# Altium project NoFollowBoard.PrjPcb
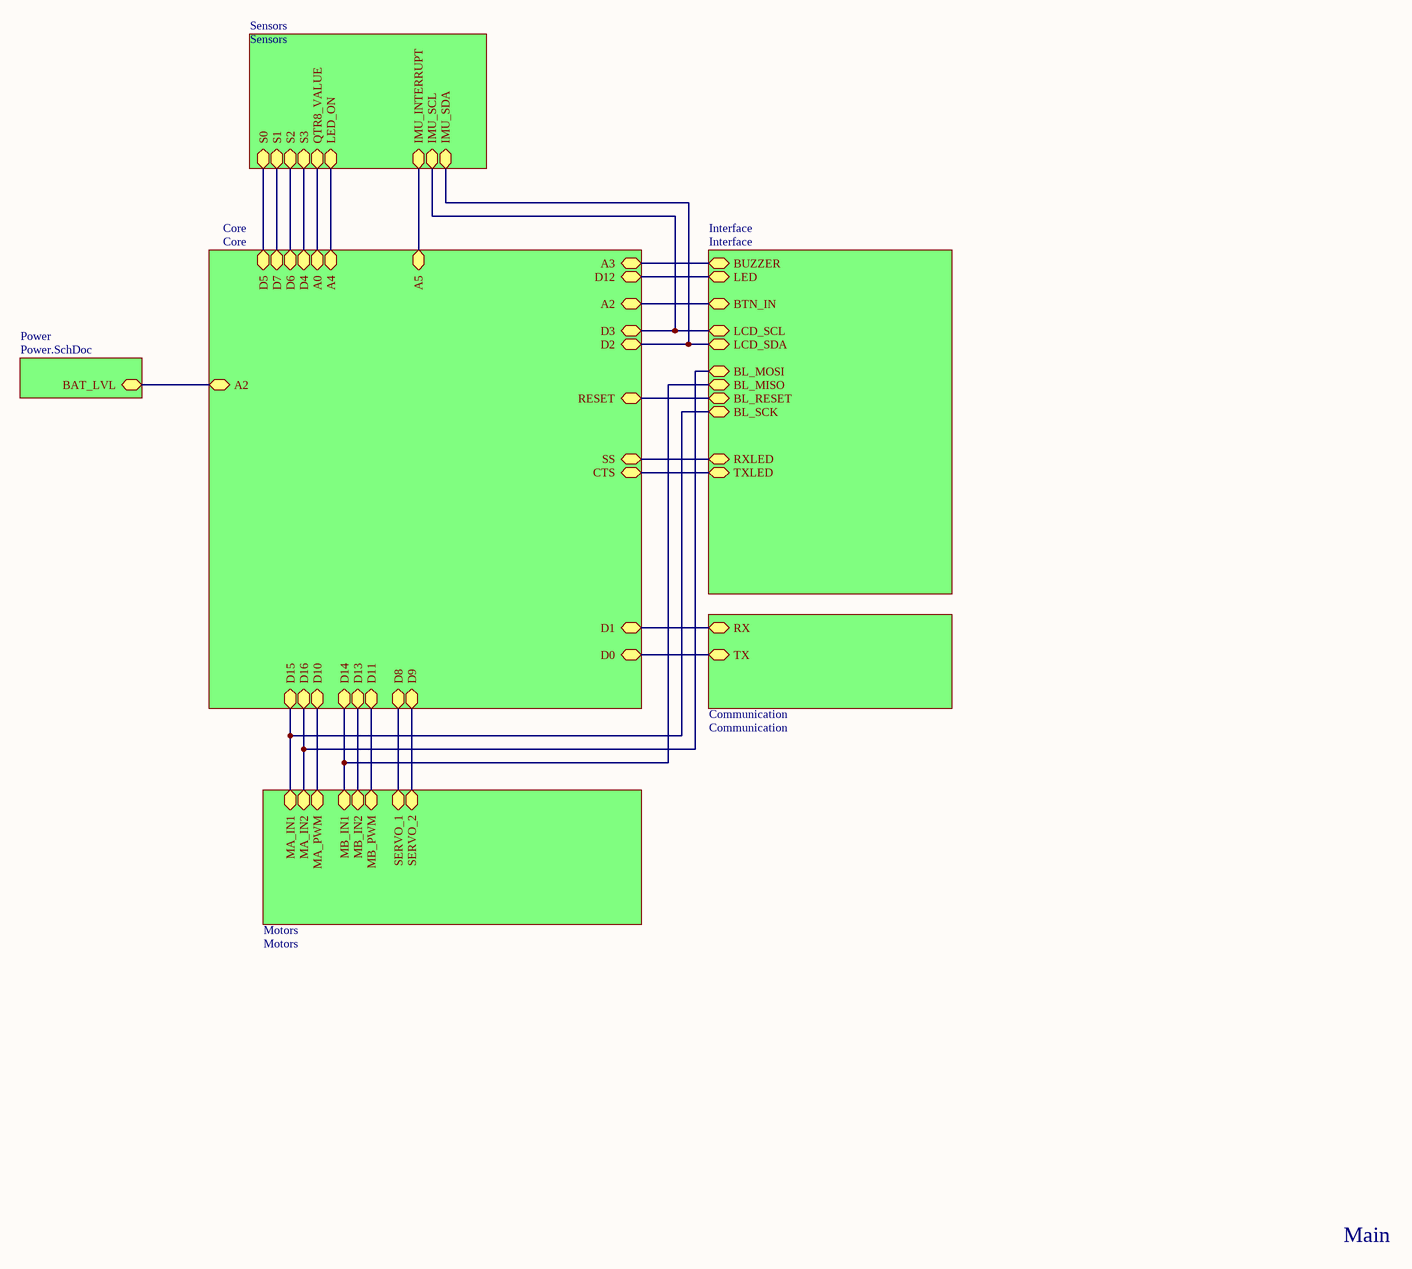
[diagram p0: Main.SchDoc]
6 sheets, 64 parts. Net scope: hierarchical (ports join the sheet entries above them; power ports are global).
Sheets:
  Main.SchDoc
    Core = Core.SchDoc
    Sensors = Sensors.SchDoc
    Interface = Interface.SchDoc
    Communication = Communication.SchDoc
    Motors = Motors.SchDoc

## Sheet Main.SchDoc
size A3

### Sub-sheets
Communication = Communication: RX (bidir), TX (bidir)
Core = Core: D5 (bidir), D7 (bidir), D6 (bidir), D4 (bidir), A0 (bidir), A3 (bidir), D12 (bidir), A2 (bidir), D1 (bidir), D0 (bidir), D13 (bidir), D14 (bidir), D10 (bidir), D16 (bidir), D15 (bidir), D11 (bidir), D8 (bidir), A4, A2, D9, RESET, SS (bidir), CTS (bidir), D3, D2, A5
Interface = Interface: BUZZER (bidir), LED (bidir), BTN_IN (bidir), LCD_SCL (bidir), LCD_SDA (bidir), BL_MOSI, BL_MISO, BL_RESET, BL_SCK, RXLED (bidir), TXLED (bidir)
Motors = Motors: MA_IN1 (bidir), MA_IN2 (bidir), MA_PWM (bidir), MB_IN1 (bidir), MB_IN2 (bidir), MB_PWM (bidir), SERVO_1 (bidir), SERVO_2
Power = Power.SchDoc (file not in this document): BAT_LVL
Sensors = Sensors: S0 (bidir), S1 (bidir), S2 (bidir), S3 (bidir), QTR8_VALUE (bidir), LED_ON, IMU_INTERRUPT (bidir), IMU_SCL (bidir), IMU_SDA (bidir)

### Nets
RESET: sheet Core/RESET, sheet Interface/BL_RESET
NetB1_B: sheet Core/A2, sheet Core/A2, sheet Interface/BTN_IN, sheet Power/BAT_LVL
NetGY1_3: sheet Core/D3, sheet Sensors/IMU_SCL, sheet Interface/LCD_SCL
NetGY1_4: sheet Core/D2, sheet Sensors/IMU_SDA, sheet Interface/LCD_SDA
NetGY1_8: sheet Core/A5, sheet Sensors/IMU_INTERRUPT
NetJ2_1: sheet Core/D14, sheet Interface/BL_MISO, sheet Motors/MB_IN1
NetJ2_3: sheet Core/D15, sheet Interface/BL_SCK, sheet Motors/MA_IN1
NetJ2_4: sheet Core/D16, sheet Interface/BL_MOSI, sheet Motors/MA_IN2
NetJ4_3: sheet Core/D8, sheet Motors/SERVO_1
NetJ5_3: sheet Core/D9, sheet Motors/SERVO_2
NetJ6_9: sheet Core/A4, sheet Sensors/LED_ON
NetLED_Rx_1: sheet Core/SS, sheet Interface/RXLED
NetLED_Tx_1: sheet Core/CTS, sheet Interface/TXLED
NetMUX1_1: sheet Core/A0, sheet Sensors/QTR8_VALUE
NetMUX1_10: sheet Core/D5, sheet Sensors/S0
NetMUX1_11: sheet Core/D7, sheet Sensors/S1
NetMUX1_13: sheet Core/D4, sheet Sensors/S3
NetMUX1_14: sheet Core/D6, sheet Sensors/S2
NetR1_2: sheet Core/D1, sheet Communication/RX
NetR7_2: sheet Core/D12, sheet Interface/LED
NetR8_2: sheet Core/A3, sheet Interface/BUZZER
NetR13_2: sheet Core/D13, sheet Motors/MB_IN2
NetU1_12: sheet Core/D11, sheet Motors/MB_PWM
NetU1_20: sheet Core/D0, sheet Communication/TX
NetU1_30: sheet Core/D10, sheet Motors/MA_PWM

### Notes on the sheet
- Main

## Sheet Core.SchDoc
size A
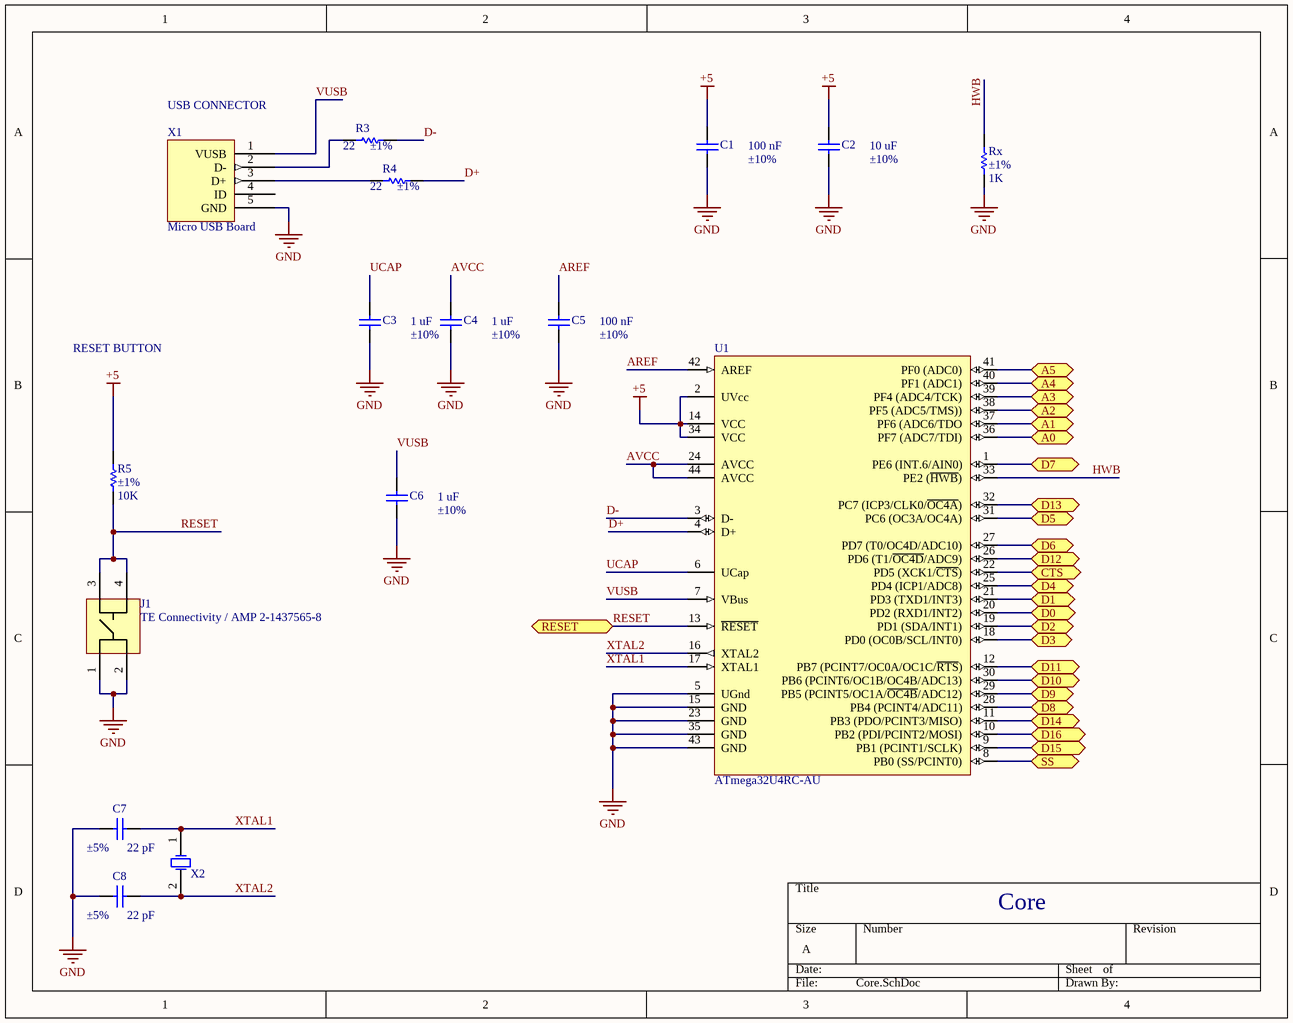
[diagram p1: Core.SchDoc]

### Parts
C1  Capacitance: 100 nF  Capacitance Tolerance: ±10%  [PCB-i747o4qnz4fc2aqkwc14-1]  (hidden comment: Taiyo Yuden LMK212BJ106KG-T)
C2  Capacitance: 10 uF  Capacitance Tolerance: ±10%  [PCB-i747o4qnz4fc2aqkwc14-1]  (hidden comment: Taiyo Yuden LMK212BJ106KG-T)
C3  Capacitance: 1 uF  Capacitance Tolerance: ±10%  [PCB-i747o4qnz4fc2aqkwc14-1]  (hidden comment: Taiyo Yuden LMK212BJ106KG-T)
C4  Capacitance: 1 uF  Capacitance Tolerance: ±10%  [PCB-i747o4qnz4fc2aqkwc14-1]  (hidden comment: Taiyo Yuden LMK212BJ106KG-T)
C5  Capacitance: 100 nF  Capacitance Tolerance: ±10%  [PCB-i747o4qnz4fc2aqkwc14-1]  (hidden comment: Taiyo Yuden LMK212BJ106KG-T)
C6  Capacitance: 1 uF  Capacitance Tolerance: ±10%  [PCB-i747o4qnz4fc2aqkwc14-1]  (hidden comment: Taiyo Yuden LMK212BJ106KG-T)
C7  Capacitance: 22 pF  Capacitance Tolerance: ±5%  [PCB-i747o4qnz4fc2aqkwc14-1]  (hidden comment: Taiyo Yuden LMK212BJ106KG-T)
C8  Capacitance: 22 pF  Capacitance Tolerance: ±5%  [PCB-i747o4qnz4fc2aqkwc14-1]  (hidden comment: Taiyo Yuden LMK212BJ106KG-T)
J1  TE Connectivity / AMP 2-1437565-8  [PCB-70k6oqbhuv68f7gyhifn-1]
R3  Resistance Tolerance: ±1%  Resistance: 22  [PCB-4097432-1]  (hidden comment: Bourns CR0805-FX-4701GLF)
R4  Resistance Tolerance: ±1%  Resistance: 22  [PCB-4097432-1]  (hidden comment: Bourns CR0805-FX-4701GLF)
R5  Resistance Tolerance: ±1%  Resistance: 10K  [PCB-4097432-1]  (hidden comment: Bourns CR0805-FX-4701GLF)
Rx  Resistance Tolerance: ±1%  Resistance: 1K  [PCB-4097432-1]  (hidden comment: Bourns CR0805-FX-4701GLF)
U1  ATmega32U4RC-AU  [44ML_L]
X1  Micro USB Board  [PCB-y0d6oczsv3eu57ue5a53-1]
X2  Fox Electronics FOXSDLF/160-20  [FOX-FOXSDLF-160-20]  (value not drawn)

### Ports
A0 (bidir), A1 (bidir), A2 (bidir), A3 (bidir), A4 (bidir), A5 (bidir), CTS (bidir), D0 (bidir), D1 (bidir), D2 (bidir), D3 (bidir), D4 (bidir), D5 (bidir), D6 (bidir), D7 (bidir), D8 (bidir), D9 (bidir), D10 (bidir), D11 (bidir), D12 (bidir), D13 (bidir), D14 (bidir), D15 (bidir), D16 (bidir), RESET, SS (bidir)

### Nets
+5: C1.2 C2.2 R5.2 U1.2(UVcc) U1.14(VCC) U1.34(VCC)
GND: C1.1 C2.1 C3.1 C4.1 C5.1 C6.1 C7.1 C8.1 J1.1 J1.2 Rx.1 U1.5(UGnd) U1.15(GND) U1.23(GND) U1.35(GND) U1.43(GND) X1.5(GND)
AREF: C5.2 U1.42(AREF)
AVCC: C4.2 U1.24(AVCC) U1.44(AVCC)
D+: R4.2 U1.4(D+)
D-: R3.2 U1.3(D-)
HWB: Rx.2 U1.33(PE2_(~{HWB}))
RESET: J1.3 J1.4 R5.1 U1.13(~{RESET}) ; port RESET
UCAP: C3.2 U1.6(UCap)
VUSB: C6.2 U1.7(VBus) X1.1(VUSB)
XTAL1: C7.2 U1.17(XTAL1) X2.1(OSC1)
XTAL2: C8.2 U1.16(XTAL2) X2.2(OSC2)
NetB1_B: U1.38(PF5_(ADC5/TMS))) ; port A2
NetGY1_3: U1.18(PD0_(OC0B/SCL/INT0)) ; port D3
NetGY1_4: U1.19(PD1_(SDA/INT1)) ; port D2
NetGY1_8: U1.41(PF0_(ADC0)) ; port A5
NetJ2_1: U1.11(PB3_(PDO/PCINT3/MISO)) ; port D14
NetJ2_3: U1.9(PB1_(PCINT1/SCLK)) ; port D15
NetJ2_4: U1.10(PB2_(PDI/PCINT2/MOSI)) ; port D16
NetJ4_3: U1.28(PB4_(PCINT4/ADC11)) ; port D8
NetJ5_3: U1.29(PB5_(PCINT5/OC1A/~{OC4B}/ADC12)) ; port D9
NetJ6_9: U1.40(PF1_(ADC1)) ; port A4
NetLED_Rx_1: U1.8(PB0_(SS/PCINT0)) ; port SS
NetLED_Tx_1: U1.22(PD5_(XCK1/~{CTS})) ; port CTS
NetMUX1_1: U1.36(PF7_(ADC7/TDI)) ; port A0
NetMUX1_10: U1.31(PC6_(OC3A/OC4A)) ; port D5
NetMUX1_11: U1.1(PE6_(INT.6/AIN0)) ; port D7
NetMUX1_13: U1.25(PD4_(ICP1/ADC8)) ; port D4
NetMUX1_14: U1.27(PD7_(T0/OC4D/ADC10)) ; port D6
NetR1_2: U1.21(PD3_(TXD1/INT3)) ; port D1
NetR3_1: R3.1 X1.2(D-)
NetR4_1: R4.1 X1.3(D+)
NetR7_2: U1.26(PD6_(T1/~{OC4D}/ADC9)) ; port D12
NetR8_2: U1.39(PF4_(ADC4/TCK)) ; port A3
NetR13_2: U1.32(PC7_(ICP3/CLK0/~{OC4A})) ; port D13
NetU1_12: U1.12(PB7_(PCINT7/OC0A/OC1C/~{RTS})) ; port D11
NetU1_20: U1.20(PD2_(RXD1/INT2)) ; port D0
NetU1_30: U1.30(PB6_(PCINT6/OC1B/OC4B/ADC13)) ; port D10
NetU1_37: U1.37(PF6_(ADC6/TDO) ; port A1

Not connected (* = marked no-connect by the designer): X1 4(ID)

### Notes on the sheet
- (near X1) USB CONNECTOR
- RESET BUTTON
- Core

### Library data of the parts
C1-C8 = CMP-6ecba7c24c09b10c-2: Cap Ceramic 10uF 10V X5R 10% SMD 0805 85?C T/R; Lead-Free Status: Lead Free; Voltage Rating (DC): 10.0 V; Case/Package (SI): 2012; Mounting Style: Surface Mount; Manufacturer Part Number: LMK212BJ106KG-T; Packaging: Cut Tape (CT); RoHS: Compliant; Number of Pins: 2; Lifecycle Status: Not Listed by Manufacturer; OctopartID: 6ecba7c24c09b10c; Size-Length: 0.002 m; Size-Height: 0.00125 m; Dielectric Characteristic: X5R; Octopart URL: http://octopart.com/lmk212bj106kg-t-taiyo+yuden-198564; Size-Width: 0.00125 m; Case/Package: 0805
J1 = 2-1437565-8: Switch Tactile OFF (ON) SPST Round Button Gull Wing 0.05A 12VDC 2.55N SMD Loose Piece; ELV Compliant: Compliant; Lead-Free Status: Lead Free; Contact Material: Copper Alloy; Contacts Type: SPST; Mounting Style: Surface Mount; OctopartID: fb7e300dae6a24b9; Lifecycle Status: Active; Manufacturer Part Number: 2-1437565-8; Contact Plating: Silver; RoHS: Compliant; Octopart URL: http://octopart.com/2-1437565-8-te+connectivity+%2F+amp-41513074
R3-R5 Rx = CMP-97505e06006c4897-1: Res Thick Film 0805 4.7K Ohm 1% 1/8W ±100ppm/°C Molded SMD SMD Paper Tape on Plastic Reel; Voltage Rating (DC): 150 V; Power Rating: 125 mW; Manufacturer Part Number: CR0805-FX-4701GLF; REACH SVHC Compliance: No SVHC; OctopartID: 97505e06006c4897; Packaging: Tape & Reel (TR), Cut Tape (CT); Octopart URL: http://octopart.com/cr0805-fx-4701glf-bourns-6074970; Number of Pins: 2; Mounting Style: Surface Mount; RoHS: Compliant; Size-Thickness: 508 µm; Size-Length: 2.01 mm; Case/Package: 0805; Size-Width: 1.24 mm
U1 = ATMEGA32U4RC-AU: 8-bit AVR Microcontroller, 2.7-5.5V, 16MHz, 32KB Flash, 1KB EEPROM, 2.5KB SRAM, USB Controller, 44-pin TQFP, Industrial Grade (-40°C to 85°C), Int RC; Manufacturer: Atmel; Processor Series: ATMEGA32x; CiivaID: 973239; On-Chip ADC: Yes; Data Bus Width: 8 bit; Operating Supply Voltage: 2.7 V to 5.5 V; Core: AVR; Data RAM Size: 2.5 KB; Mounting Style: SMD/SMT; Maximum Clock Frequency: 16 MHz; Operating Temperature Range: - 40 C to + 85 C; Program Memory Size: 32 KB; RoHS: Details; Package / Case: QFP-44; Factory Pack Quantity: 800; Ciiva URL: https://ciiva.com/part/atmega32u4rc-au-973239
X1 = CMP-dryhiu0utvtqwfw1f267-2: CustomComponentID: dryhiu0utvtqwfw1f267
X2 = CMP-779572-4: CRYSTAL 16.0MHZ 20PF SMD; Frequency: 16000000.0 Hz; Lead-Free Status: Lead Free; Load Capacitance: 2e-11 F; Size-Height: 0.0045 m; REACH SVHC Compliance: No SVHC; Size-Length: 0.0129 m; RoHS: Compliant; Mounting Style: Surface Mount; Case/Package: HC-49; Packaging: Cut Tape (CT); Octopart Url: https://octopart.com/foxsdlf%2F160-20-fox+electronics-126664; OctopartID: 4a7c837781d295bb; Number of Pins: 2; Size-Width: 0.005 m

## Sheet Sensors.SchDoc
size A3; PageSetup: Record=PageOptions|CenterHorizontal=True|CenterVertical=True|PrintScale=1.00|XCorrection=1.00|YCorrection=1.00|PrintKind=1|BorderSize=5000000|LeftOffset=0|BottomOffset=0|Orientation=2|PaperLength=1000|PaperWidth=1000|Scale=100|PaperSource=7|PrintQuality=-3|MediaType=1|DitherType=10|PrintScaleMode=1|PaperKind=A2|PaperIndex=66
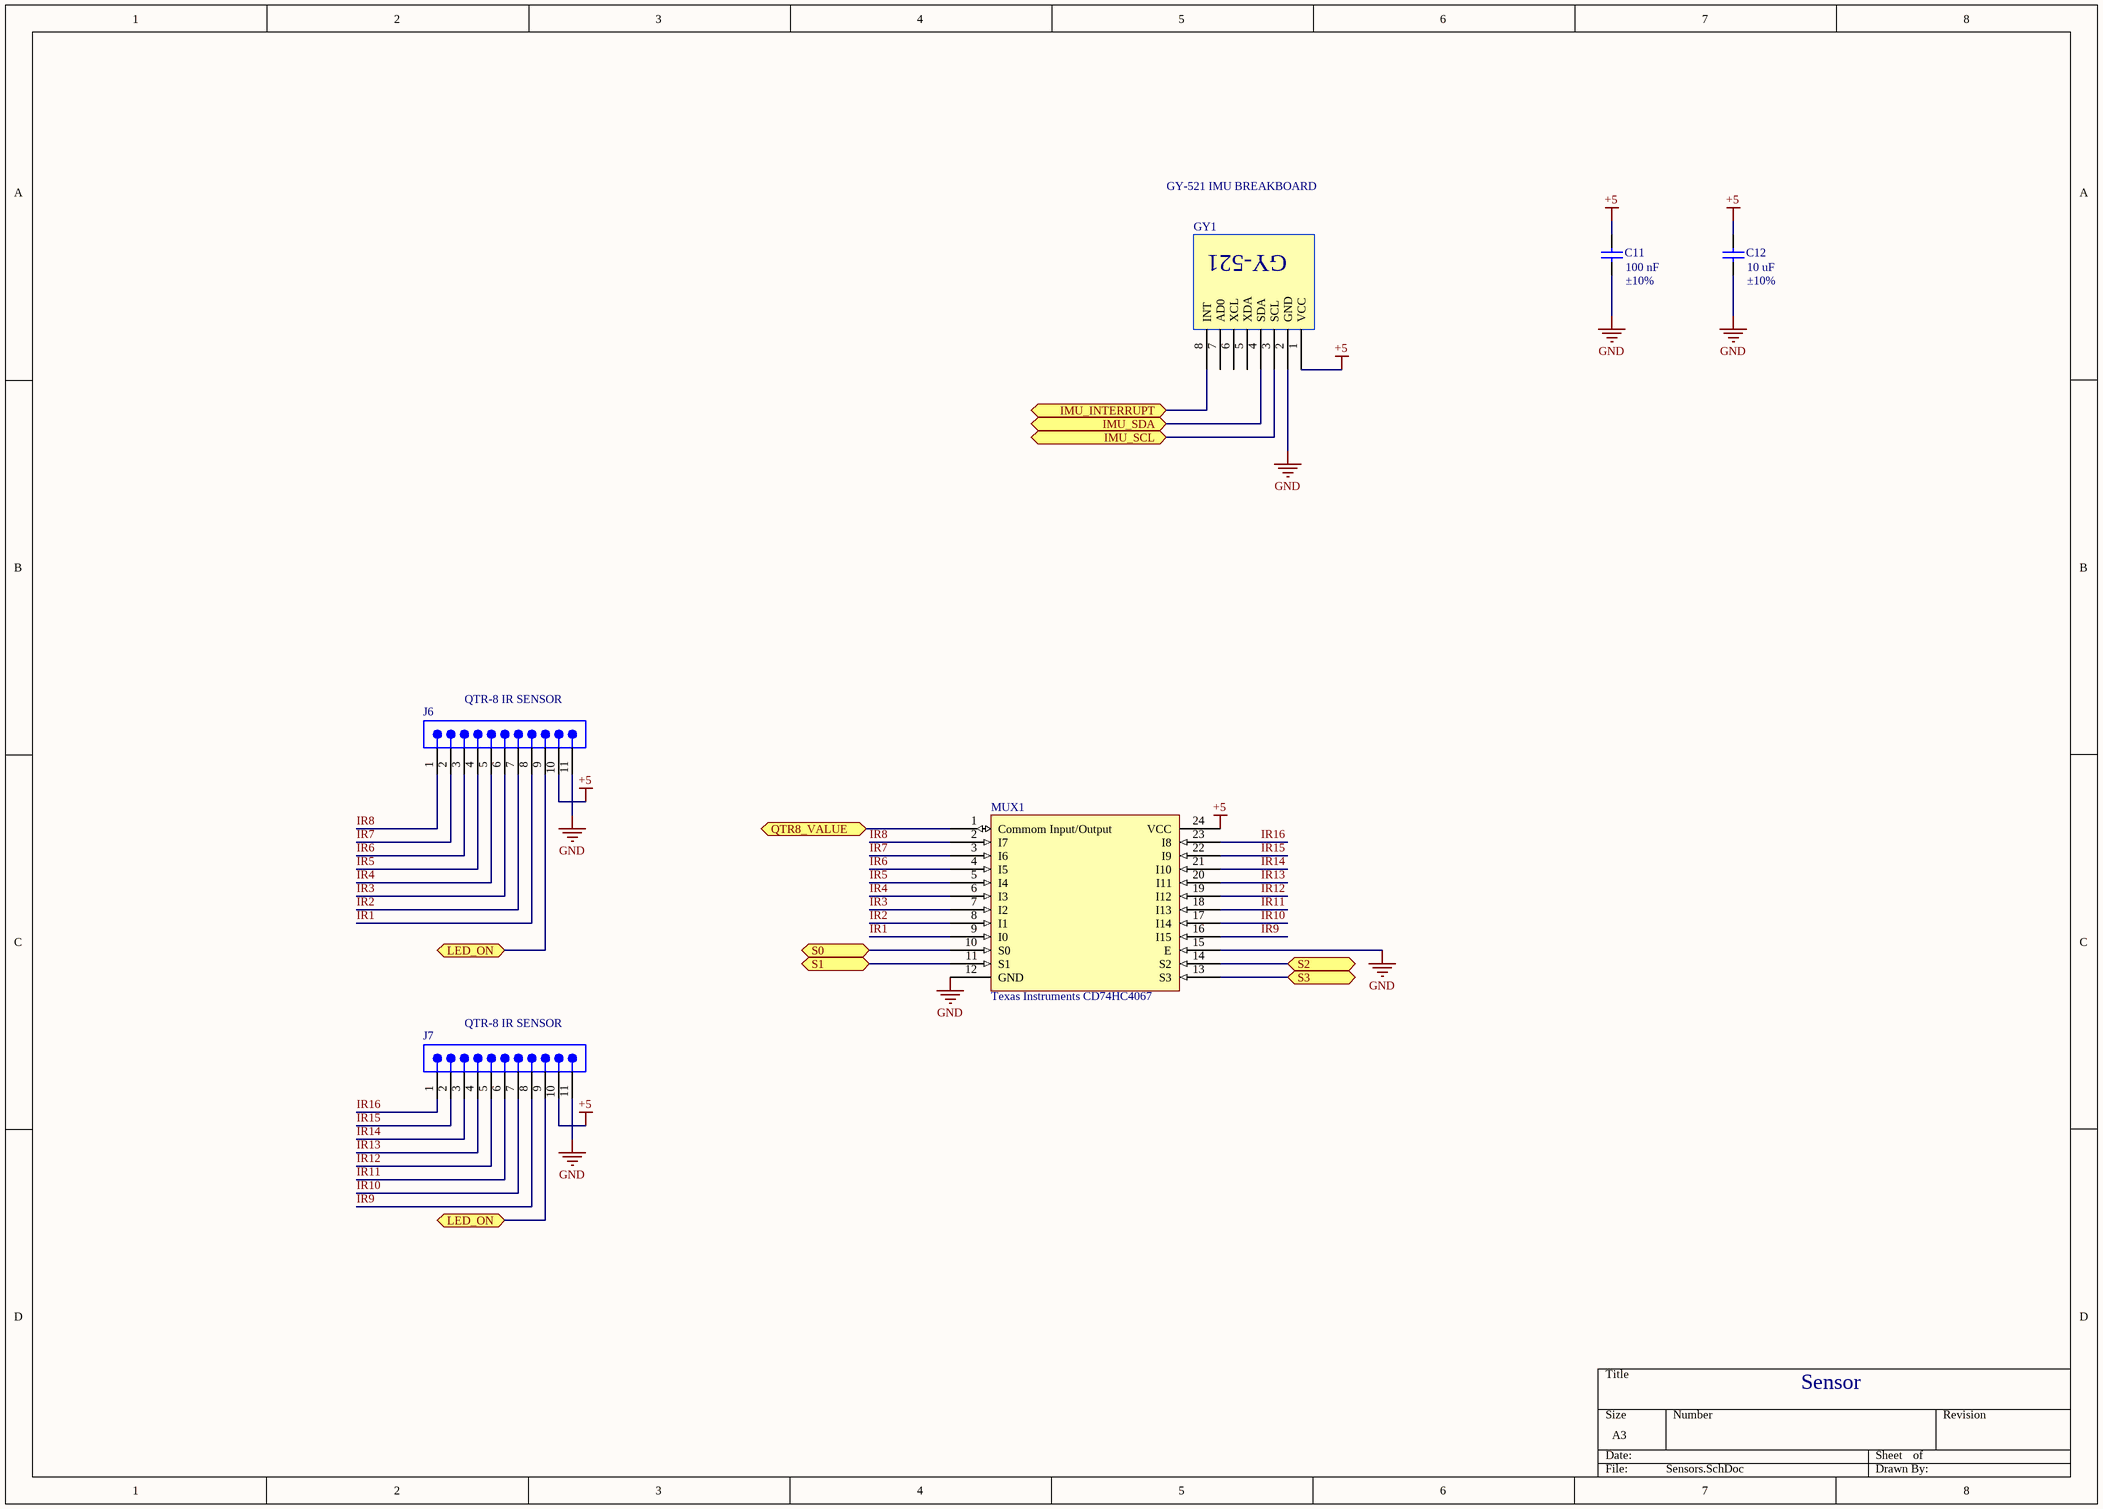
[diagram p2: Sensors.SchDoc]

### Parts
C11  Capacitance: 100 nF  Capacitance Tolerance: ±10%  [PCB-i747o4qnz4fc2aqkwc14-1]  (hidden comment: Taiyo Yuden LMK212BJ106KG-T)
C12  Capacitance: 10 uF  Capacitance Tolerance: ±10%  [PCB-i747o4qnz4fc2aqkwc14-1]  (hidden comment: Taiyo Yuden LMK212BJ106KG-T)
GY1  GY-521 MPU-6050 IMU  [PCBComponent_1]  (value not drawn)
J6  Samtec TSW-111-05-G-S  [1X11]  (value not drawn)
J7  Samtec TSW-111-05-G-S  [1X11]  (value not drawn)
MUX1  Texas Instruments CD74HC4067  [PCBComponent_1 - duplicate]

### Ports
IMU_INTERRUPT (bidir), IMU_SCL (bidir), IMU_SDA (bidir), LED_ON (bidir), QTR8_VALUE (bidir), S0 (bidir), S1 (bidir), S2 (bidir), S3 (bidir)

### Nets
+5: C11.2 C12.2 GY1.1(VCC) J6.10 J7.10 MUX1.24(VCC)
GND: C11.1 C12.1 GY1.2(GND) J6.11 J7.11 MUX1.12(GND) MUX1.15(E)
IR1: J6.8 MUX1.9(I0)
IR2: J6.7 MUX1.8(I1)
IR3: J6.6 MUX1.7(I2)
IR4: J6.5 MUX1.6(I3)
IR5: J6.4 MUX1.5(I4)
IR6: J6.3 MUX1.4(I5)
IR7: J6.2 MUX1.3(I6)
IR8: J6.1 MUX1.2(I7)
IR9: J7.8 MUX1.16(I15)
IR10: J7.7 MUX1.17(I14)
IR11: J7.6 MUX1.18(I13)
IR12: J7.5 MUX1.19(I12)
IR13: J7.4 MUX1.20(I11)
IR14: J7.3 MUX1.21(I10)
IR15: J7.2 MUX1.22(I9)
IR16: J7.1 MUX1.23(I8)
NetGY1_3: GY1.3(SCL) ; port IMU_SCL
NetGY1_4: GY1.4(SDA) ; port IMU_SDA
NetGY1_8: GY1.8(INT) ; port IMU_INTERRUPT
NetJ6_9: J6.9 J7.9 ; port LED_ON
NetMUX1_1: MUX1.1(Commom_Input/Output) ; port QTR8_VALUE
NetMUX1_10: MUX1.10(S0) ; port S0
NetMUX1_11: MUX1.11(S1) ; port S1
NetMUX1_13: MUX1.13(S3) ; port S3
NetMUX1_14: MUX1.14(S2) ; port S2

Not connected (* = marked no-connect by the designer): GY1 5(XDA) 6(XCL) 7(AD0)

### Notes on the sheet
- GY-521 IMU BREAKBOARD
- (near J6) QTR-8 IR SENSOR
- (near J7) QTR-8 IR SENSOR
- Sensor
- (in symbol CMP-1172158-5) GY-521

### Library data of the parts
C11 C12 = CMP-6ecba7c24c09b10c-2: as C1 on sheet Core; Mounting Style: Surface Mount; Manufacturer Part Number: LMK212BJ106KG-T; Packaging: Cut Tape (CT); RoHS: Compliant; Number of Pins: 2; Lifecycle Status: Not Listed by Manufacturer; OctopartID: 6ecba7c24c09b10c; Size-Length: 0.002 m; Size-Height: 0.00125 m; Dielectric Characteristic: X5R; Octopart URL: http://octopart.com/lmk212bj106kg-t-taiyo+yuden-198564; Size-Width: 0.00125 m; Case/Package: 0805
GY1 = CMP-1172158-5: 3-axis gyroscope, 3-axis accelerometer breakout board; Supply Voltage (DC): 5v; Packaging: Cut Tape (CT); REACH SVHC Compliance: No SVHC; Number of Pins: 8; Octopart URL: http://octopart.com/mpu-6050-invensense-19505926; OctopartID: 29a8e18bafc8f66f; RoHS: Compliant; Manufacturer Part Number: MPU-6050
J6 J7 = CMP-3970764-2: CONN HEADER 11POS .100" SGL GOLD; Gender: Male; Lead-Free Status: Lead Free; Number of Contacts: 11; Pin Pitch: 0.00254 m; Contact Material: Phosphor Bronze; Contact Plating: Gold; Housing Color: Black; Housing Material: Plastic; Mounting Style: Through Hole; Number of Positions: 11; Number of Rows: 1; Octopart Url: https://octopart.com/tsw-111-05-g-s-samtec-271406; OctopartID: 84944d9a85dc5b53; REACH SVHC Compliance: No SVHC; RoHS: Compliant; Size-Height: 0.00254 m; Size-Length: 0.02794 m; Size-Width: 0.00254 m
MUX1 = CMP-106ed96303d9cfa9-6: High Speed CMOS 16-Channel Analog Multiplexer/Demultiplexer 24-SSOP -55 to 125; Manufacturer Part Number: CD74HC4067SM96; Supply Voltage (DC): 2.00 V (min); Number of Bits: 16; Lead-Free Status: Lead Free; Number of Circuits: 1; Polarity: Non-Inverting; Mounting Style: Surface Mount; OctopartID: 106ed96303d9cfa9; Case/Package: SSOP; Number of Outputs: 16; Number of Channels: 16; RoHS: Compliant; Number of Pins: 24; Lifecycle Status: Active; REACH SVHC Compliance: No SVHC; Packaging: Tape & Reel (TR), Cut Tape (CT); Octopart URL: http://octopart.com/cd74hc4067sm96-texas+instruments-472785

## Sheet Interface.SchDoc
size A
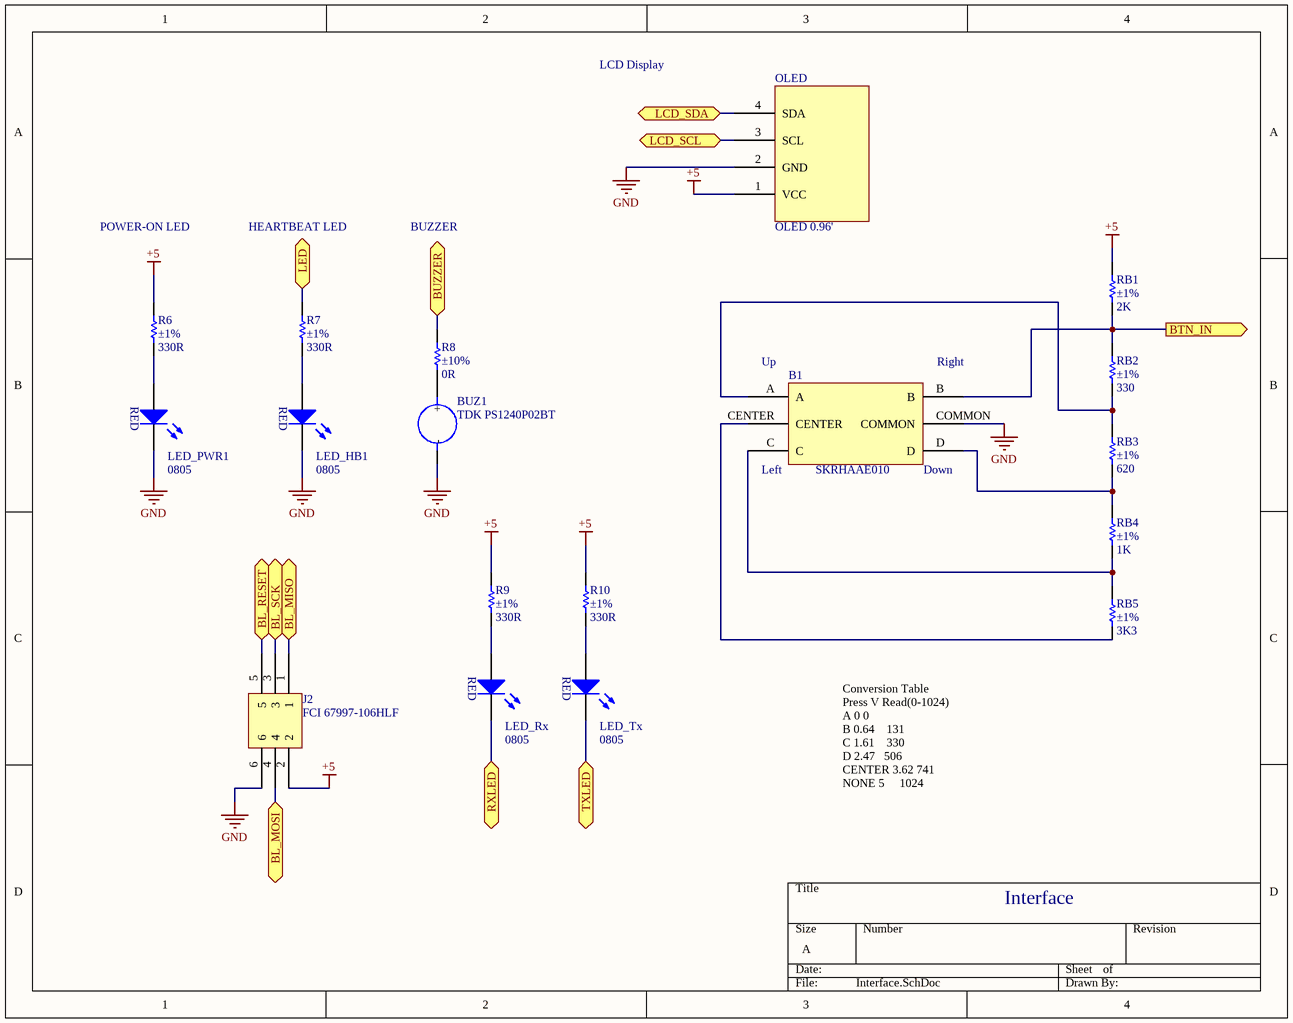
[diagram p3: Interface.SchDoc]

### Parts
B1  SKRHAAE010  [PCB-uddfpa39w3pawwu0f32n-1]
BUZ1  TDK PS1240P02BT  [2P-7.6-D12X6.5H]
J2  FCI 67997-106HLF  [PCB-94q9r8plw7fzhg0k9c12-1]
LED_HB1  Case/Package: 0805  [LED0805]  (hidden comment: CMP-7f15b6173d91a0d2-5)
LED_PWR1  Case/Package: 0805  [LED0805]  (hidden comment: CMP-7f15b6173d91a0d2-5)
LED_Rx  Case/Package: 0805  [LED0805]  (hidden comment: CMP-7f15b6173d91a0d2-5)
LED_Tx  Case/Package: 0805  [LED0805]  (hidden comment: CMP-7f15b6173d91a0d2-5)
OLED  OLED 0.96'  [PCBComponent_1 - duplicate]
R6  Resistance Tolerance: ±1%  Resistance: 330R  [PCB-4097432-1]  (hidden comment: Bourns CR0805-FX-4701GLF)
R7  Resistance Tolerance: ±1%  Resistance: 330R  [PCB-4097432-1]  (hidden comment: Bourns CR0805-FX-4701GLF)
R8  Resistance Tolerance: ±10%  Resistance: 0R  [PCB-4097432-1]  (hidden comment: Bourns CR0805-FX-4701GLF)
R9  Resistance Tolerance: ±1%  Resistance: 330R  [PCB-4097432-1]  (hidden comment: Bourns CR0805-FX-4701GLF)
R10  Resistance Tolerance: ±1%  Resistance: 330R  [PCB-4097432-1]  (hidden comment: Bourns CR0805-FX-4701GLF)
RB1  Resistance Tolerance: ±1%  Resistance: 2K  [PCB-4097432-1]  (hidden comment: Bourns CR0805-FX-4701GLF)
RB2  Resistance Tolerance: ±1%  Resistance: 330  [PCB-4097432-1]  (hidden comment: Bourns CR0805-FX-4701GLF)
RB3  Resistance Tolerance: ±1%  Resistance: 620  [PCB-4097432-1]  (hidden comment: Bourns CR0805-FX-4701GLF)
RB4  Resistance Tolerance: ±1%  Resistance: 1K  [PCB-4097432-1]  (hidden comment: Bourns CR0805-FX-4701GLF)
RB5  Resistance Tolerance: ±1%  Resistance: 3K3  [PCB-4097432-1]  (hidden comment: Bourns CR0805-FX-4701GLF)

### Ports
BL_MISO, BL_MOSI, BL_RESET, BL_SCK, BTN_IN (out), BUZZER (bidir), LCD_SCL (bidir), LCD_SDA (bidir), LED (bidir), RXLED (bidir), TXLED (bidir)

### Nets
+5: J2.2 OLED.1(VCC) R6.2 R9.2 R10.2 RB1.2
GND: B1.COMMON BUZ1.- J2.6 LED_HB1.1(K) LED_PWR1.1(K) OLED.2(GND)
RESET: J2.5 ; port BL_RESET
NetB1_A: B1.A RB2.1 RB3.2
NetB1_B: B1.B RB1.1 RB2.2 ; port BTN_IN
NetB1_C: B1.C RB4.1 RB5.2
NetB1_CENTER: B1.CENTER RB5.1
NetB1_D: B1.D RB3.1 RB4.2
NetBUZ1_+: BUZ1.+ R8.1
NetGY1_3: OLED.3(SCL) ; port LCD_SCL
NetGY1_4: OLED.4(SDA) ; port LCD_SDA
NetJ2_1: J2.1 ; port BL_MISO
NetJ2_3: J2.3 ; port BL_SCK
NetJ2_4: J2.4 ; port BL_MOSI
NetLED_HB1_2: LED_HB1.2(A) R7.1
NetLED_PWR1_2: LED_PWR1.2(A) R6.1
NetLED_Rx_1: LED_Rx.1(K) ; port RXLED
NetLED_Rx_2: LED_Rx.2(A) R9.1
NetLED_Tx_1: LED_Tx.1(K) ; port TXLED
NetLED_Tx_2: LED_Tx.2(A) R10.1
NetR7_2: R7.2 ; port LED
NetR8_2: R8.2 ; port BUZZER

### Notes on the sheet
- LCD Display
- POWER-ON LED
- HEARTBEAT LED
- BUZZER
- (near B1) Up
- (near B1) Right
- (near B1) Left
- (near B1) Down
- Conversion Table
  Press	V	Read(0-1024)
  A	0	0
  B	0.64   	131
  C	1.61   	330
  D	2.47  	506
  CENTER	3.62	741
  NONE	5    	1024
- Interface
- (in symbol CMP-7f15b6173d91a0d2-5) RED

### Library data of the parts
B1 = CMP-0t5k0v9upau5edea4oo5-8: TACT switch 4-direction with Center-Push Function (Surface Mount); CustomComponentID: 0t5k0v9upau5edea4oo5
BUZ1 = PS1240P02BT: Audio Indicator Buzzer Piezo 3Vo-p Pin Through Hole; Lead-Free Status: Lead Free; RoHS: Compliant; Octopart Url: http://octopart.com/ps1240p02bt-tdk-8602108; Seller Landing  Url: https://octopart-clicks.com/click/track?country=US&ak=8157f166&sig=0ee4d25&sid=5489&ppid=8602108&vpid=52084698&ct=offers; Manufacturer Part Number: PS1240P02BT; OctopartID: 93c85a41f7524c0f
J2 = CMP-c8f30399bb8b1734-1: Conn; Rect; Header; Unshrouded; 6 Pos; 2.54mm Pitch; 2-Row; Thru-Hole; BergStik; Number of Positions: 6; Gender: Male; Lead-Free Status: Lead Free; Contact Plating: Gold; RoHS: Compliant; Contact Material: Phosphor Bronze; Mounting Style: Through Hole; Pin Pitch: 2.54 mm; Number of Rows: 2; Number of Contacts: 6; Octopart URL: http://octopart.com/67997-106hlf-fci-39867934; OctopartID: c8f30399bb8b1734; Manufacturer Part Number: 67997-106HLF
LED_HB1 LED_PWR1 LED_Rx LED_Tx = CMP-7f15b6173d91a0d2-5: LED; SMD; 0805; red; 7.2-17mcd; 2x1.25mm; 170°; 1.8÷2.6V; 20mA; Manufacturer Part Number: HSMH-C170; Lead-Free Status: Lead Free; Lens Type: Diffused; Power Dissipation: 0.065 W; Voltage Rating (DC): 1.8 V; Luminous Intensity: 0.017 cd; Lens Color: Clear; Peak Wavelength: 6.6e-07 m; Wavelength: 6.39e-07 m; Case/Package (SI): 2012; RoHS: Compliant; Number of Pins: 2; Forward Voltage: 1.8 V; Packaging: Cut Tape (CT); Viewing Angle: 170 °; Octopart URL: http://octopart.com/hsmh-c170-avago-550882; REACH SVHC Compliance: No SVHC; Order Code (RS Components): 486-0468; Color: Red; OctopartID: 7f15b6173d91a0d2; Lifecycle Status: Active; Mounting Style: Surface Mount, Vertical; Part Description: *
OLED = CMP-am4xhbx8j6fw9q56sa5u-8: 0.96' oled i2c screen; CustomComponentID: am4xhbx8j6fw9q56sa5u
R6-R10 RB1-RB5 = CMP-97505e06006c4897-1: as R3 on sheet Core; Manufacturer Part Number: CR0805-FX-4701GLF; REACH SVHC Compliance: No SVHC; OctopartID: 97505e06006c4897; Packaging: Tape & Reel (TR), Cut Tape (CT); Octopart URL: http://octopart.com/cr0805-fx-4701glf-bourns-6074970; Number of Pins: 2; Mounting Style: Surface Mount; RoHS: Compliant; Size-Thickness: 508 µm; Size-Length: 2.01 mm; Case/Package: 0805; Size-Width: 1.24 mm

## Sheet Communication.SchDoc
size A
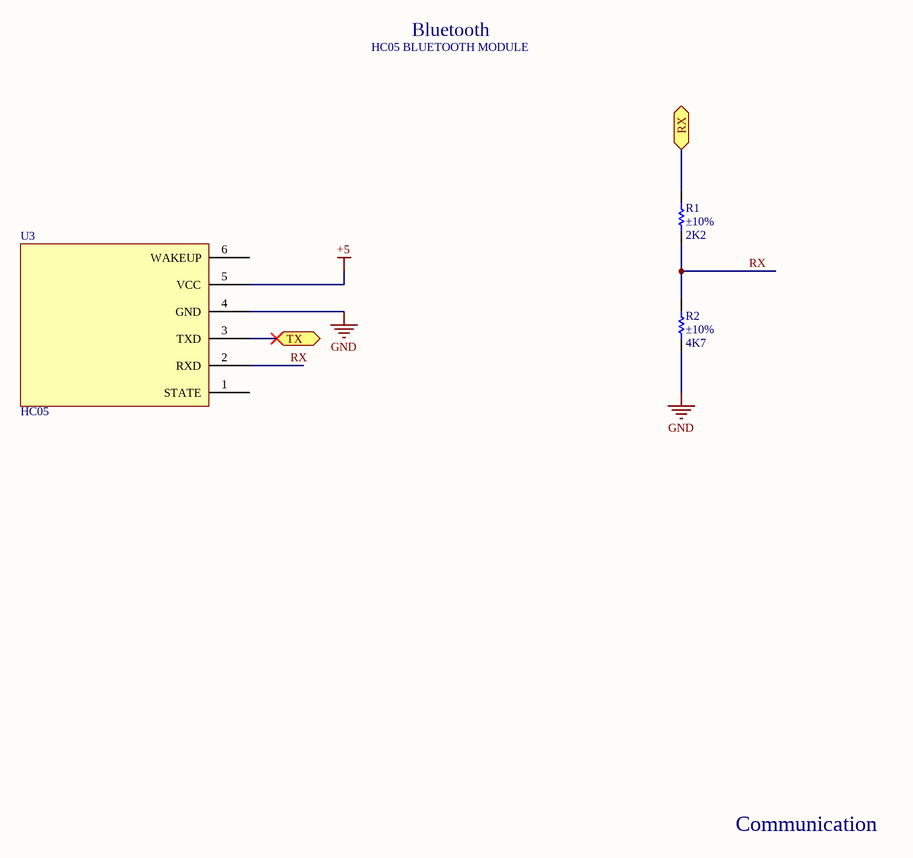
[diagram p4: Communication.SchDoc]

### Parts
R1  Resistance Tolerance: ±10%  Resistance: 2K2  [PCB-4097432-1]  (hidden comment: Bourns CR0805-FX-4701GLF)
R2  Resistance Tolerance: ±10%  Resistance: 4K7  [PCB-4097432-1]  (hidden comment: Bourns CR0805-FX-4701GLF)
U3  HC05  [PCB-y69srl1b5ua4hsssdbd0-1]

### Ports
RX (bidir), TX (bidir)

### Nets
+5: U3.5(VCC)
GND: R2.1 U3.4(GND)
RX: R1.1 R2.2 U3.2(RXD)
NetR1_2: R1.2 ; port RX
NetU1_20: U3.3(TXD) ; port TX

Not connected (* = marked no-connect by the designer): U3 1(STATE) 6(WAKEUP)

### Notes on the sheet
- HC05 BLUETOOTH MODULE
- Bluetooth
- Communication

### Library data of the parts
R1 R2 = CMP-97505e06006c4897-1: as R3 on sheet Core; Manufacturer Part Number: CR0805-FX-4701GLF; REACH SVHC Compliance: No SVHC; OctopartID: 97505e06006c4897; Packaging: Tape & Reel (TR), Cut Tape (CT); Octopart URL: http://octopart.com/cr0805-fx-4701glf-bourns-6074970; Number of Pins: 2; Mounting Style: Surface Mount; RoHS: Compliant; Size-Thickness: 508 µm; Size-Length: 2.01 mm; Case/Package: 0805; Size-Width: 1.24 mm
U3 = CMP-32y43k4doi7edrbsy63c-2: hc05 BT module; CustomComponentID: 32y43k4doi7edrbsy63c

## Sheet Motors.SchDoc
size A
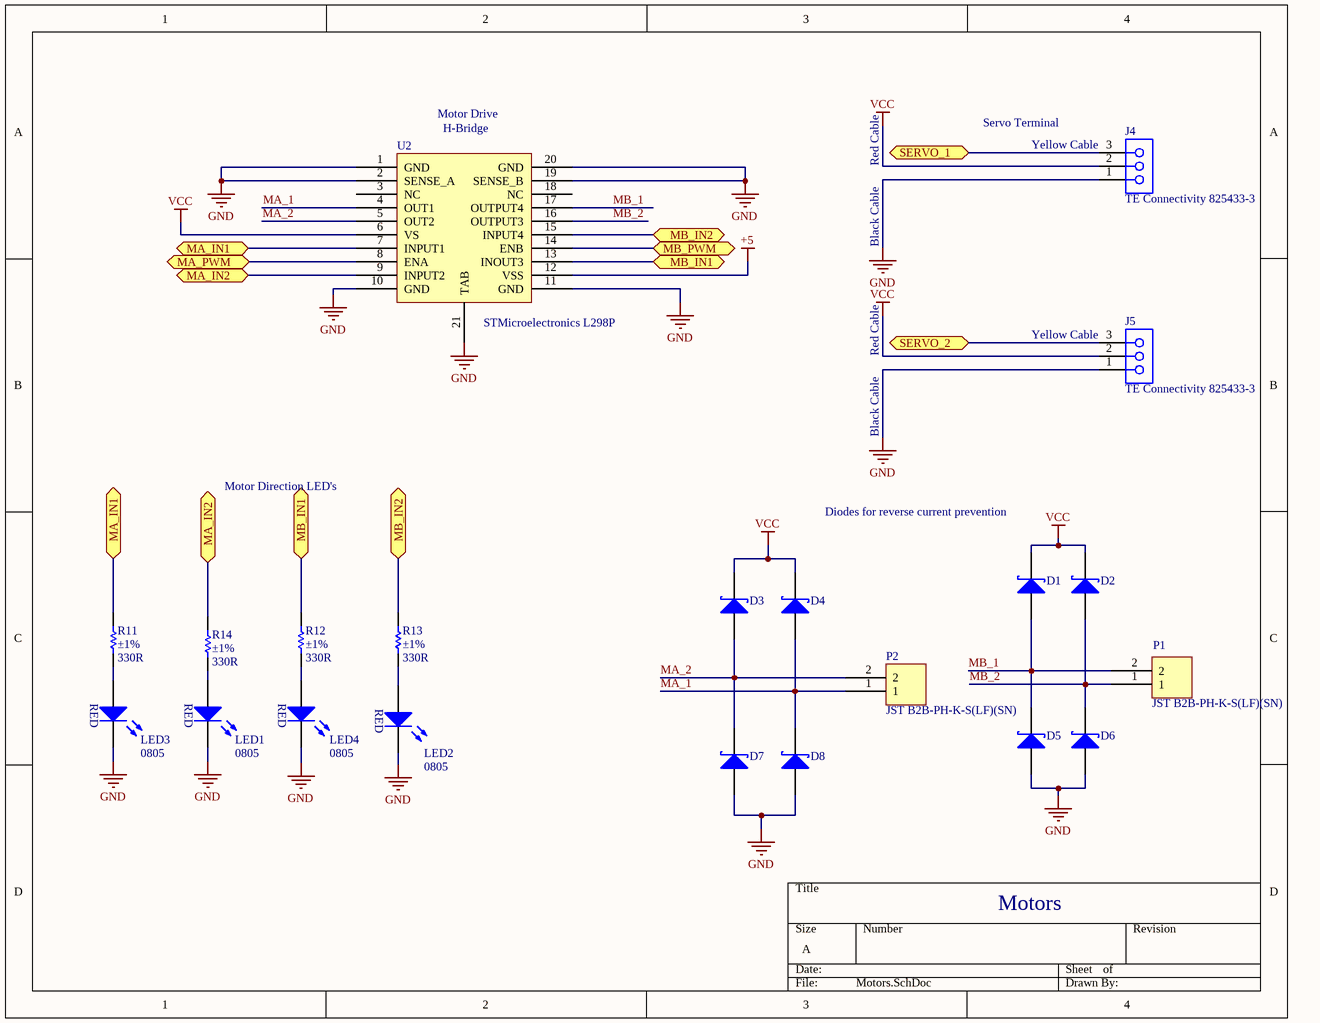
[diagram p5: Motors.SchDoc]

### Parts
D1  SS34 SMA DO-214AC  [SMA]  (value not drawn)
D2  SS34 SMA DO-214AC  [SMA]  (value not drawn)
D3  SS34 SMA DO-214AC  [SMA]  (value not drawn)
D4  SS34 SMA DO-214AC  [SMA]  (value not drawn)
D5  SS34 SMA DO-214AC  [SMA]  (value not drawn)
D6  SS34 SMA DO-214AC  [SMA]  (value not drawn)
D7  SS34 SMA DO-214AC  [SMA]  (value not drawn)
D8  SS34 SMA DO-214AC  [SMA]  (value not drawn)
J4  TE Connectivity 825433-3  [PCB-43x6b8o6d5mxbq35c0sh-1]
J5  TE Connectivity 825433-3  [PCB-43x6b8o6d5mxbq35c0sh-1]
LED1  Case/Package: 0805  [LED0805]  (hidden comment: CMP-7f15b6173d91a0d2-5)
LED2  Case/Package: 0805  [LED0805]  (hidden comment: CMP-7f15b6173d91a0d2-5)
LED3  Case/Package: 0805  [LED0805]  (hidden comment: CMP-7f15b6173d91a0d2-5)
LED4  Case/Package: 0805  [LED0805]  (hidden comment: CMP-7f15b6173d91a0d2-5)
P1  JST B2B-PH-K-S(LF)(SN)  [PCB-gpdi66yn1jko56crxrq7-1]
P2  JST B2B-PH-K-S(LF)(SN)  [PCB-gpdi66yn1jko56crxrq7-1]
R11  Resistance Tolerance: ±1%  Resistance: 330R  [PCB-4097432-1]  (hidden comment: Bourns CR0805-FX-4701GLF)
R12  Resistance Tolerance: ±1%  Resistance: 330R  [PCB-4097432-1]  (hidden comment: Bourns CR0805-FX-4701GLF)
R13  Resistance Tolerance: ±1%  Resistance: 330R  [PCB-4097432-1]  (hidden comment: Bourns CR0805-FX-4701GLF)
R14  Resistance Tolerance: ±1%  Resistance: 330R  [PCB-4097432-1]  (hidden comment: Bourns CR0805-FX-4701GLF)
U2  STMicroelectronics L298P  [L298PSOIC127P1420X360-20N]

### Ports
MA_IN1 (bidir), MA_IN2 (bidir), MA_PWM (bidir), MB_IN1 (bidir), MB_IN2 (bidir), MB_PWM (bidir), SERVO_1 (bidir), SERVO_2 (bidir)

### Nets
+5: U2.12(VSS)
GND: D5.1(A) D6.1(A) D7.1(A) D8.1(A) J4.1 J5.1 LED1.1(K) LED2.1(K) LED3.1(K) LED4.1(K) U2.1(GND) U2.2(SENSE_A) U2.10(GND) U2.11(GND) U2.19(SENSE_B) U2.20(GND) U2.21(TAB)
VCC: D1.2(K) D2.2(K) D3.2(K) D4.2(K) J4.2 J5.2 U2.6(VS)
MA_1: D4.1(A) D8.2(K) P2.1 U2.4(OUT1)
MA_2: D3.1(A) D7.2(K) P2.2 U2.5(OUT2)
MB_1: D1.1(A) D5.2(K) P1.2 U2.17(OUTPUT4)
MB_2: D2.1(A) D6.2(K) P1.1 U2.16(OUTPUT3)
NetJ2_1: R12.2 U2.13(INOUT3) ; port MB_IN1
NetJ2_3: R11.2 U2.7(INPUT1) ; port MA_IN1
NetJ2_4: R14.2 U2.9(INPUT2) ; port MA_IN2
NetJ4_3: J4.3 ; port SERVO_1
NetJ5_3: J5.3 ; port SERVO_2
NetLED1_2: LED1.2(A) R14.1
NetLED2_2: LED2.2(A) R13.1
NetLED3_2: LED3.2(A) R11.1
NetLED4_2: LED4.2(A) R12.1
NetR13_2: R13.2 U2.15(INPUT4) ; port MB_IN2
NetU1_12: U2.14(ENB) ; port MB_PWM
NetU1_30: U2.8(ENA) ; port MA_PWM

Not connected (* = marked no-connect by the designer): U2 3(NC) 18(NC)

### Notes on the sheet
- (near U2) Motor Drive
- (near U2) H-Bridge
- Red Cable
- Servo Terminal
- (near J4) Yellow Cable
- Black Cable
- (near J5) Yellow Cable
- Motor Direction LED's
- Diodes for reverse current prevention
- Motors
- (in symbol CMP-7f15b6173d91a0d2-5) RED

### Library data of the parts
D1-D8 = CMP-cx3sevj7k2ks0umzedmk-1: A Schotty Barrier Rectifier; CustomComponentID: cx3sevj7k2ks0umzedmk
J4 J5 = CMP-52d299a8d8748d15-5: Pin header; pin strips; AMPMODU MOD II; male; PIN: 3; straight; ELV Compliant: Compliant; Pin Pitch: 0.00254 m; Number of Contacts: 3; Current Rating: 3.0 A; Housing Color: Green; OctopartID: 52d299a8d8748d15; REACH SVHC Compliance: No SVHC; Flammability Rating: UL 94 V-0; Orientation: Vertical; Lifecycle Status: Active; Octopart URL: http://octopart.com/825433-3-te+connectivity-40939456; Housing Material: Polyester; Packaging: Box; Contact Plating: Gold, Gold over Nickel, Tin, Tin over Nickel; Gender: Male; Manufacturer Part Number: 825433-3; Mounting Style: PCB; Contact Material: Brass; RoHS: Compliant
LED1-LED4 = CMP-7f15b6173d91a0d2-5: as LED_HB1 on sheet Interface; RoHS: Compliant; Number of Pins: 2; Forward Voltage: 1.8 V; Packaging: Cut Tape (CT); Viewing Angle: 170 °; Octopart URL: http://octopart.com/hsmh-c170-avago-550882; REACH SVHC Compliance: No SVHC; Order Code (RS Components): 486-0468; Color: Red; OctopartID: 7f15b6173d91a0d2; Lifecycle Status: Active; Mounting Style: Surface Mount, Vertical; Part Description: *
P1 P2 = CMP-642947-5: PH Series 2 Position 2 mm Pitch Through Hole Top Entry Shrouded Header; Number of Positions: 2; Pin Pitch: 2.00 mm; Current Rating: 2.00 A; Insulation Resistance: 1.00 MΩ; Gender: Male; Lead-Free Status: Lead Free; Voltage Rating (AC): 100 V; Contact Resistance: 10.0 mΩ; Packaging: Bulk; RoHS: Compliant; REACH SVHC Compliance: No SVHC; Size-Length: 5.90 mm; OctopartID: a21c6b154b5e7ddb; Octopart URL: http://octopart.com/b2b-ph-k-s%28lf%29%28sn%29-jst-248868; Size-Height: 6.00 mm; Housing Material: Nylon; Size-Width: 4.50 mm; Mounting Style: Through Hole, Vertical; Manufacturer Part Number: B2B-PH-K-S(LF)(SN); Number of Rows: 1; Contact Material: Brass; Housing Color: Natural; Number of Contacts: 2; Contact Plating: Tin
R11-R14 = CMP-97505e06006c4897-1: as R3 on sheet Core; Manufacturer Part Number: CR0805-FX-4701GLF; REACH SVHC Compliance: No SVHC; OctopartID: 97505e06006c4897; Packaging: Tape & Reel (TR), Cut Tape (CT); Octopart URL: http://octopart.com/cr0805-fx-4701glf-bourns-6074970; Number of Pins: 2; Mounting Style: Surface Mount; RoHS: Compliant; Size-Thickness: 508 µm; Size-Length: 2.01 mm; Case/Package: 0805; Size-Width: 1.24 mm
U2 = CMP-1433026-16: L298 Series Dual Full Bridge 4 A 46 V Driver Surface Mount - PowerSO-20; Lead-Free Status: Lead Free; Supply Voltage (DC): 46.0 V (max); Number of Channels: 2; Manufacturer Part Number: L298P; Mounting Style: Surface Mount; Octopart URL: http://octopart.com/l298p-stmicroelectronics-468197; Packaging: Tube; RoHS: Compliant; Lifecycle Status: Active; OctopartID: b6bd7fb0b73e697a

## Nets that join several sheets
+5: Core (6 pins), Sensors (6 pins), Interface (6 pins), Communication (U3.5), Motors (U2.12)
GND: Core (17 pins), Sensors (7 pins), Interface (6 pins), Communication (R2.1 U3.4), Motors (17 pins)
NetB1_B: Core (U1.38), Interface (B1.B RB1.1 RB2.2)
NetGY1_3: Core (U1.18), Sensors (GY1.3), Interface (OLED.3)
NetGY1_4: Core (U1.19), Sensors (GY1.4), Interface (OLED.4)
NetGY1_8: Core (U1.41), Sensors (GY1.8)
NetJ2_1: Core (U1.11), Interface (J2.1), Motors (R12.2 U2.13)
NetJ2_3: Core (U1.9), Interface (J2.3), Motors (R11.2 U2.7)
NetJ2_4: Core (U1.10), Interface (J2.4), Motors (R14.2 U2.9)
NetJ4_3: Core (U1.28), Motors (J4.3)
NetJ5_3: Core (U1.29), Motors (J5.3)
NetJ6_9: Core (U1.40), Sensors (J6.9 J7.9)
NetLED_Rx_1: Core (U1.8), Interface (LED_Rx.1)
NetLED_Tx_1: Core (U1.22), Interface (LED_Tx.1)
NetMUX1_1: Core (U1.36), Sensors (MUX1.1)
NetMUX1_10: Core (U1.31), Sensors (MUX1.10)
NetMUX1_11: Core (U1.1), Sensors (MUX1.11)
NetMUX1_13: Core (U1.25), Sensors (MUX1.13)
NetMUX1_14: Core (U1.27), Sensors (MUX1.14)
NetR1_2: Core (U1.21), Communication (R1.2)
NetR7_2: Core (U1.26), Interface (R7.2)
NetR8_2: Core (U1.39), Interface (R8.2)
NetR13_2: Core (U1.32), Motors (R13.2 U2.15)
NetU1_12: Core (U1.12), Motors (U2.14)
NetU1_20: Core (U1.20), Communication (U3.3)
NetU1_30: Core (U1.30), Motors (U2.8)
RESET: Core (J1.3 J1.4 R5.1 U1.13), Interface (J2.5)